# Altium schematic sheet lights.SchDoc
size A
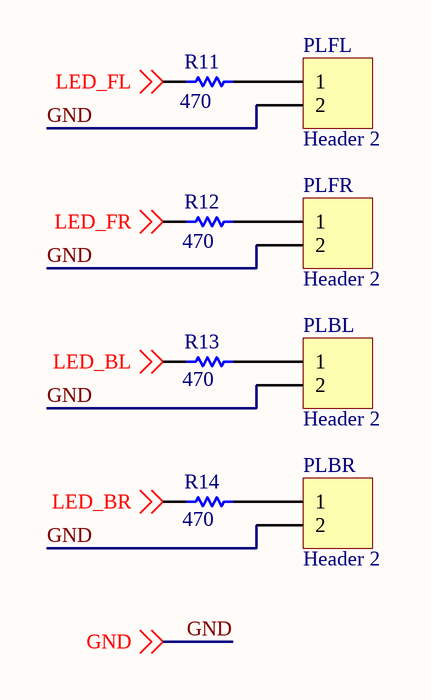
[diagram p0: lights.SchDoc]

## Parts
PLBL  Header 2  [HDR1X2]
PLBR  Header 2  [HDR1X2]
PLFL  Header 2  [HDR1X2]
PLFR  Header 2  [HDR1X2]
R11  value 470  [0805-R]  (hidden comment: Res1)
R12  value 470  [0805-R]  (hidden comment: Res1)
R13  value 470  [0805-R]  (hidden comment: Res1)
R14  value 470  [0805-R]  (hidden comment: Res1)

## Nets
GND: PLBL.2 PLBR.2 PLFL.2 PLFR.2 ; off-sheet GND
LED_BL: R13.1 ; off-sheet LED_BL
LED_BR: R14.1 ; off-sheet LED_BR
LED_FL: R11.1 ; off-sheet LED_FL
LED_FR: R12.1 ; off-sheet LED_FR
NetPLBL_1: PLBL.1 R13.2
NetPLBR_1: PLBR.1 R14.2
NetPLFL_1: PLFL.1 R11.2
NetPLFR_1: PLFR.1 R12.2

## Library data of the parts
PLBL PLBR PLFL PLFR = Header 2: Header, 2-Pin; LatestRevisionDate: 17-Jul-2002; LatestRevisionNote: Re-released for DXP Platform.; Publisher: Altium Limited
R11-R14 = Res1: Resistor; Published: 8-Jun-2000; LatestRevisionDate: 17-Jul-2002; LatestRevisionNote: Re-released for DXP Platform.; PackageReference: AXIAL-0.3; Publisher: Altium Limited; PackageDescription: Axial Device, Thru-Hole; 2 Leads; 0.3 in Pin Spacing